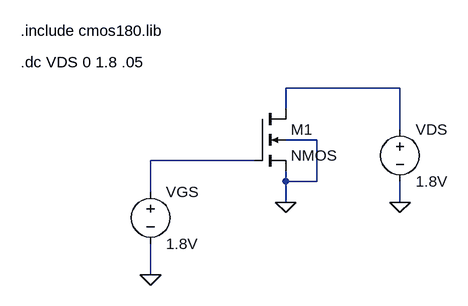
[diagram p0: schematic trichxuatThamsoLamdaNMOS.asc]
trichxuatThamsoLamdaNMOS.asc, the LTspice schematic file:
Version 4
SHEET 1 880 680
WIRE 368 48 192 48
WIRE 192 80 192 48
WIRE 368 112 368 48
WIRE 240 128 192 128
WIRE 144 160 -16 160
WIRE 192 192 192 176
WIRE 240 192 240 128
WIRE 240 192 192 192
WIRE -16 208 -16 160
WIRE 192 224 192 192
WIRE 368 224 368 192
WIRE -16 336 -16 288
FLAG 192 224 0
FLAG -16 336 0
FLAG 368 224 0
SYMBOL nmos4 144 80 R0
SYMATTR Value2 l=180n w=2u
SYMATTR InstName M1
SYMBOL voltage -16 192 R0
SYMATTR InstName VGS
SYMATTR Value 1.8V
SYMBOL voltage 368 96 R0
SYMATTR InstName VDS
SYMATTR Value 1.8V
TEXT -216 -40 Left 2 !.include cmos180.lib
TEXT -216 8 Left 2 !.dc VDS 0 1.8 .05

The netlist it stands for:
* trichxuatThamsoLamdaNMOS.asc
M1 N001 N002 0 0 NMOS l=180n w=2u
VGS N002 0 1.8V
VDS N001 0 1.8V
.model NMOS NMOS
.model PMOS PMOS
.lib standard.mos
.include cmos180.lib
.dc VDS 0 1.8 .05
.backanno
.end